# EAGLE schematic EFM_VCF6c (EAGLE 7.2.0)
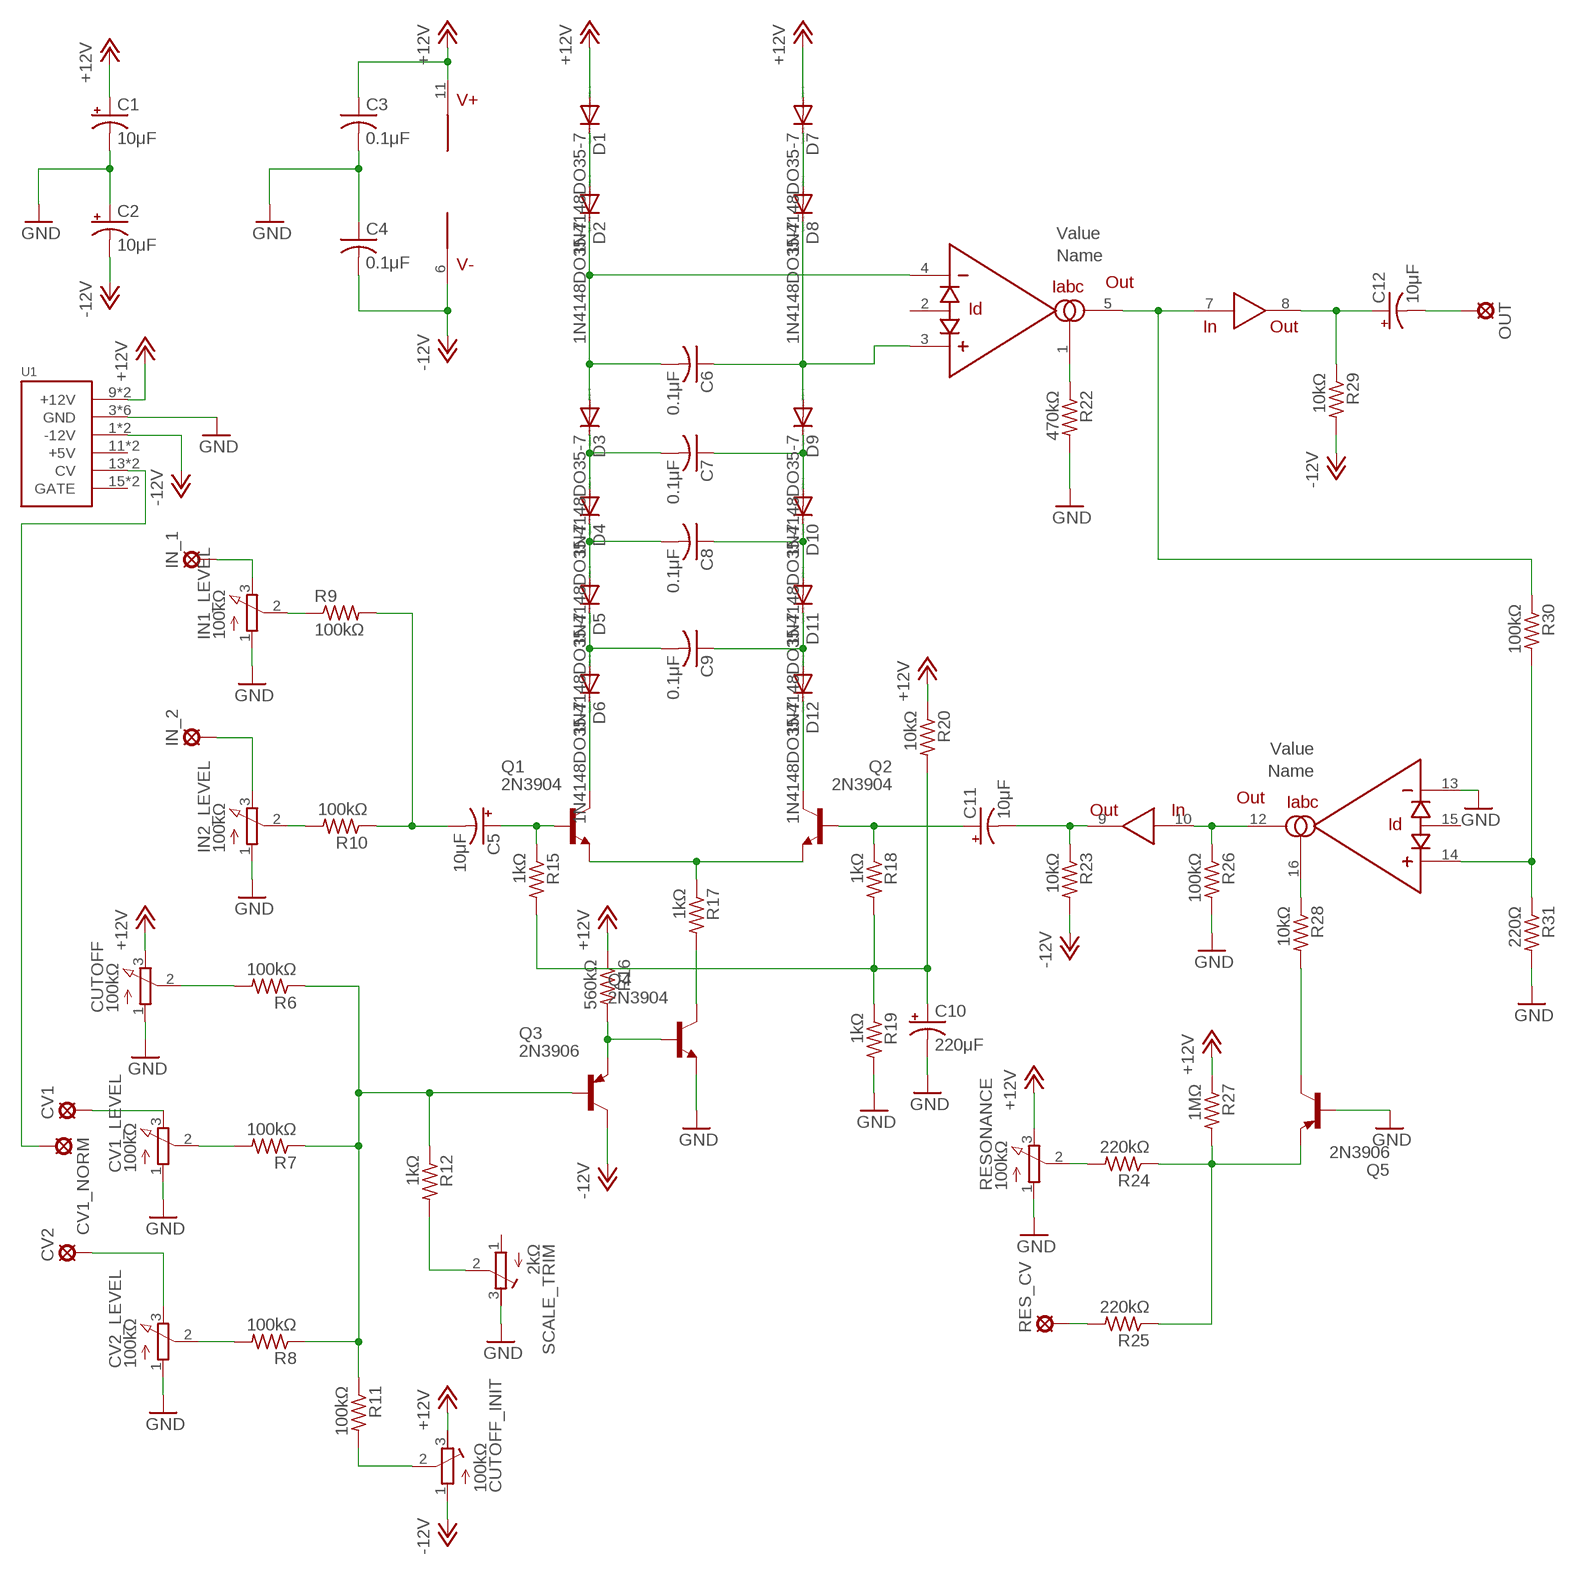
[diagram p0: schematic, sheet 1]

## Parts
C1  10μF  CPOL-USB45181A  [B45181A]
C2  10μF  CPOL-USB45181A  [B45181A]
C3  0.1μF  C-US025-030X050  [C025-030X050]
C4  0.1μF  C-US025-030X050  [C025-030X050]
C5  10μF  CPOL-USB45181A  [B45181A]
C6  0.1μF  C-US025-030X050  [C025-030X050]
C7  0.1μF  C-US025-030X050  [C025-030X050]
C8  0.1μF  C-US025-030X050  [C025-030X050]
C9  0.1μF  C-US025-030X050  [C025-030X050]
C10  220μF  CPOL-USB45181A  [B45181A]
C11  10μF  CPOL-USB45181A  [B45181A]
C12  10μF  CPOL-USB45181A  [B45181A]
CUTOFF  100kΩ  3RP/1610N  [3RP/1610N]
CUTOFF_INIT  100kΩ  R-TRIMM64W  [RTRIM64W]
CV1  LSP10  [LSP10]
CV1_LEVEL  100kΩ  3RP/1610N  [3RP/1610N]
CV1_NORM  LSP10  [LSP10]
CV2  LSP10  [LSP10]
CV2_LEVEL  100kΩ  3RP/1610N  [3RP/1610N]
D1  1N4148DO35-7  [DO35-7]
D2  1N4148DO35-7  [DO35-7]
D3  1N4148DO35-7  [DO35-7]
D4  1N4148DO35-7  [DO35-7]
D5  1N4148DO35-7  [DO35-7]
D6  1N4148DO35-7  [DO35-7]
D7  1N4148DO35-7  [DO35-7]
D8  1N4148DO35-7  [DO35-7]
D9  1N4148DO35-7  [DO35-7]
D10  1N4148DO35-7  [DO35-7]
D11  1N4148DO35-7  [DO35-7]
D12  1N4148DO35-7  [DO35-7]
IC1  LM13700N  [DIL16]
IN1_LEVEL  100kΩ  3RP/1610N  [3RP/1610N]
IN2_LEVEL  100kΩ  3RP/1610N  [3RP/1610N]
IN_1  LSP10  [LSP10]
IN_2  LSP10  [LSP10]
OUT  LSP10  [LSP10]
Q1  2N3904  [TO92]
Q2  2N3904  [TO92]
Q3  2N3906  [TO92]
Q4  2N3904  [TO92]
Q5  2N3906  [TO92]
R6  100kΩ  R-US_0207/7  [0207/7]
R7  100kΩ  R-US_0207/7  [0207/7]
R8  100kΩ  R-US_0207/7  [0207/7]
R9  100kΩ  R-US_0207/7  [0207/7]
R10  100kΩ  R-US_0207/7  [0207/7]
R11  100kΩ  R-US_0207/7  [0207/7]
R12  1kΩ  R-US_0207/7  [0207/7]
R15  1kΩ  R-US_0207/7  [0207/7]
R16  560kΩ  R-US_0207/7  [0207/7]
R17  1kΩ  R-US_0207/7  [0207/7]
R18  1kΩ  R-US_0207/7  [0207/7]
R19  1kΩ  R-US_0207/7  [0207/7]
R20  10kΩ  R-US_0207/7  [0207/7]
R22  470kΩ  R-US_0207/7  [0207/7]
R23  10kΩ  R-US_0207/7  [0207/7]
R24  220kΩ  R-US_0207/7  [0207/7]
R25  220kΩ  R-US_0207/7  [0207/7]
R26  100kΩ  R-US_0207/7  [0207/7]
R27  1MΩ  R-US_0207/7  [0207/7]
R28  10kΩ  R-US_0207/7  [0207/7]
R29  10kΩ  R-US_0207/7  [0207/7]
R30  100kΩ  R-US_0207/7  [0207/7]
R31  220Ω  R-US_0207/7  [0207/7]
RES_CV  LSP10  [LSP10]
RESONANCE  100kΩ  3RP/1610N  [3RP/1610N]
SCALE_TRIM  2kΩ  R-TRIMM64W  [RTRIM64W]
U1  POWER  [POWER_16]

## Nets
-12V: C2.- C4.2 CUTOFF_INIT.1(A) IC1.6(V-) Q3.1(C) R23.2 R29.2 U1.1(-12V) U1.2(-12V)
GND: C1.- C2.+ C3.2 C4.1 C10.- CUTOFF.1(A) CV1_LEVEL.1(A) CV2_LEVEL.1(A) IC1.13(B:-IN) IN1_LEVEL.1(A) IN2_LEVEL.1(A) Q4.3(E) Q5.2(B) R19.2 R22.2 R26.2 R31.2 RESONANCE.1(A) SCALE_TRIM.3(E) U1.3(GND) U1.4(GND) U1.5(GND) U1.6(GND) U1.7(GND) U1.8(GND)
N$1: IC1.1(A:IABC) R22.1
N$2: R25.2 RES_CV.MP
N$3: Q4.1(C) R17.2
N$4: Q1.3(E) Q2.3(E) R17.1
N$5: IN2_LEVEL.2(S) R10.2
N$6: C5.- R9.2 R10.1
N$7: C5.+ Q1.2(B) R15.1
N$8: Q3.3(E) Q4.2(B) R16.2
N$9: C6.2 D2.C D3.A IC1.4(A:-IN)
N$10: CV2_LEVEL.2(S) R8.2
N$11: IC1.5(A:OUT) IC1.7(IN) R30.1
N$12: C6.1 D8.C D9.A IC1.3(A:+IN)
N$13: C7.1 D9.C D10.A
N$14: C8.2 D4.C D5.A
N$15: C8.1 D10.C D11.A
N$16: Q3.2(B) R6.1 R7.1 R8.1 R11.1 R12.1
N$17: C9.1 D11.C D12.A
N$18: C9.2 D5.C D6.A
N$19: D6.C Q1.1(C)
N$20: D12.C Q2.1(C)
N$21: D1.C D2.A
N$22: D7.C D8.A
N$23: R24.2 RESONANCE.2(S)
N$24: Q5.3(E) R24.1 R25.1 R27.2
N$25: C10.+ R15.2 R18.2 R19.1 R20.2
N$26: C11.+ Q2.2(B) R18.1
N$27: CUTOFF_INIT.2(S) R11.2
N$28: C12.+ IC1.8(OUT) R29.1
N$29: C7.2 D3.C D4.A
N$30: IC1.14(B:+IN) R30.2 R31.1
N$31: C12.- OUT.MP
N$32: IC1.16(B:IABC) R28.1
N$33: Q5.1(C) R28.2
N$34: IN2_LEVEL.3(E) IN_2.MP
N$35: C11.- IC1.9(OUT) R23.1
N$36: IC1.10(IN) IC1.12(B:OUT) R26.1
N$37: R12.2 SCALE_TRIM.2(S)
N$38: C1.+ C3.1 CUTOFF.3(E) CUTOFF_INIT.3(E) D1.A D7.A IC1.11(V+) R16.1 R20.1 R27.1 RESONANCE.3(E) U1.9(+12V) U1.10(+12V) ; supply symbol labelled +12V
N$53: CV1_LEVEL.2(S) R7.2
N$54: CV2.MP CV2_LEVEL.3(E)
N$55: CV1_NORM.MP U1.13(CV) U1.14(CV)
N$56: CUTOFF.2(S) R6.2
N$57: IN1_LEVEL.2(S) R9.1
N$58: IN1_LEVEL.3(E) IN_1.MP
N$59: CV1.MP CV1_LEVEL.3(E)
Unconnected: IC1.2(A:ID) IC1.15(B:ID) SCALE_TRIM.1(A) U1.11(+5V) U1.12(+5V) U1.15(GATE) U1.16(GATE)

## Library data of the parts
C1 C2 C5 C10-C12 = rcl:CPOL-US: POLARIZED CAPACITOR, American symbol
C3 C4 C6-C9 = rcl:C-US: CAPACITOR, American symbol
CUTOFF CV1_LEVEL CV2_LEVEL IN1_LEVEL IN2_LEVEL RESONANCE = pot:3RP/1610N: 16mm Potentiometer one level Source: http://www.alphapotentiometers.net/html/16mm_pot_2.html
CUTOFF_INIT SCALE_TRIM = rcl:R-TRIMM: Trimm resistor
CV1 CV1_NORM CV2 IN_1 IN_2 OUT RES_CV = solpad:LSP10: SOLDER PAD drill 1.0 mm, distributor Buerklin, 12H555
D1-D12 = diode:1N4148: DIODE high speed (Philips)
IC1 = synthdiy updated imperial:LM13700: National Dual OTA with buffers.
Q1 Q2 Q4 = transistor-npn:2N3904: NPN Transistor
Q3 Q5 = transistor-pnp:2N3906: PNP Transistor
R6-R12 R15-R20 R22-R31 = rcl:R-US_: RESISTOR, American symbol
U1 = eurorack:POWER